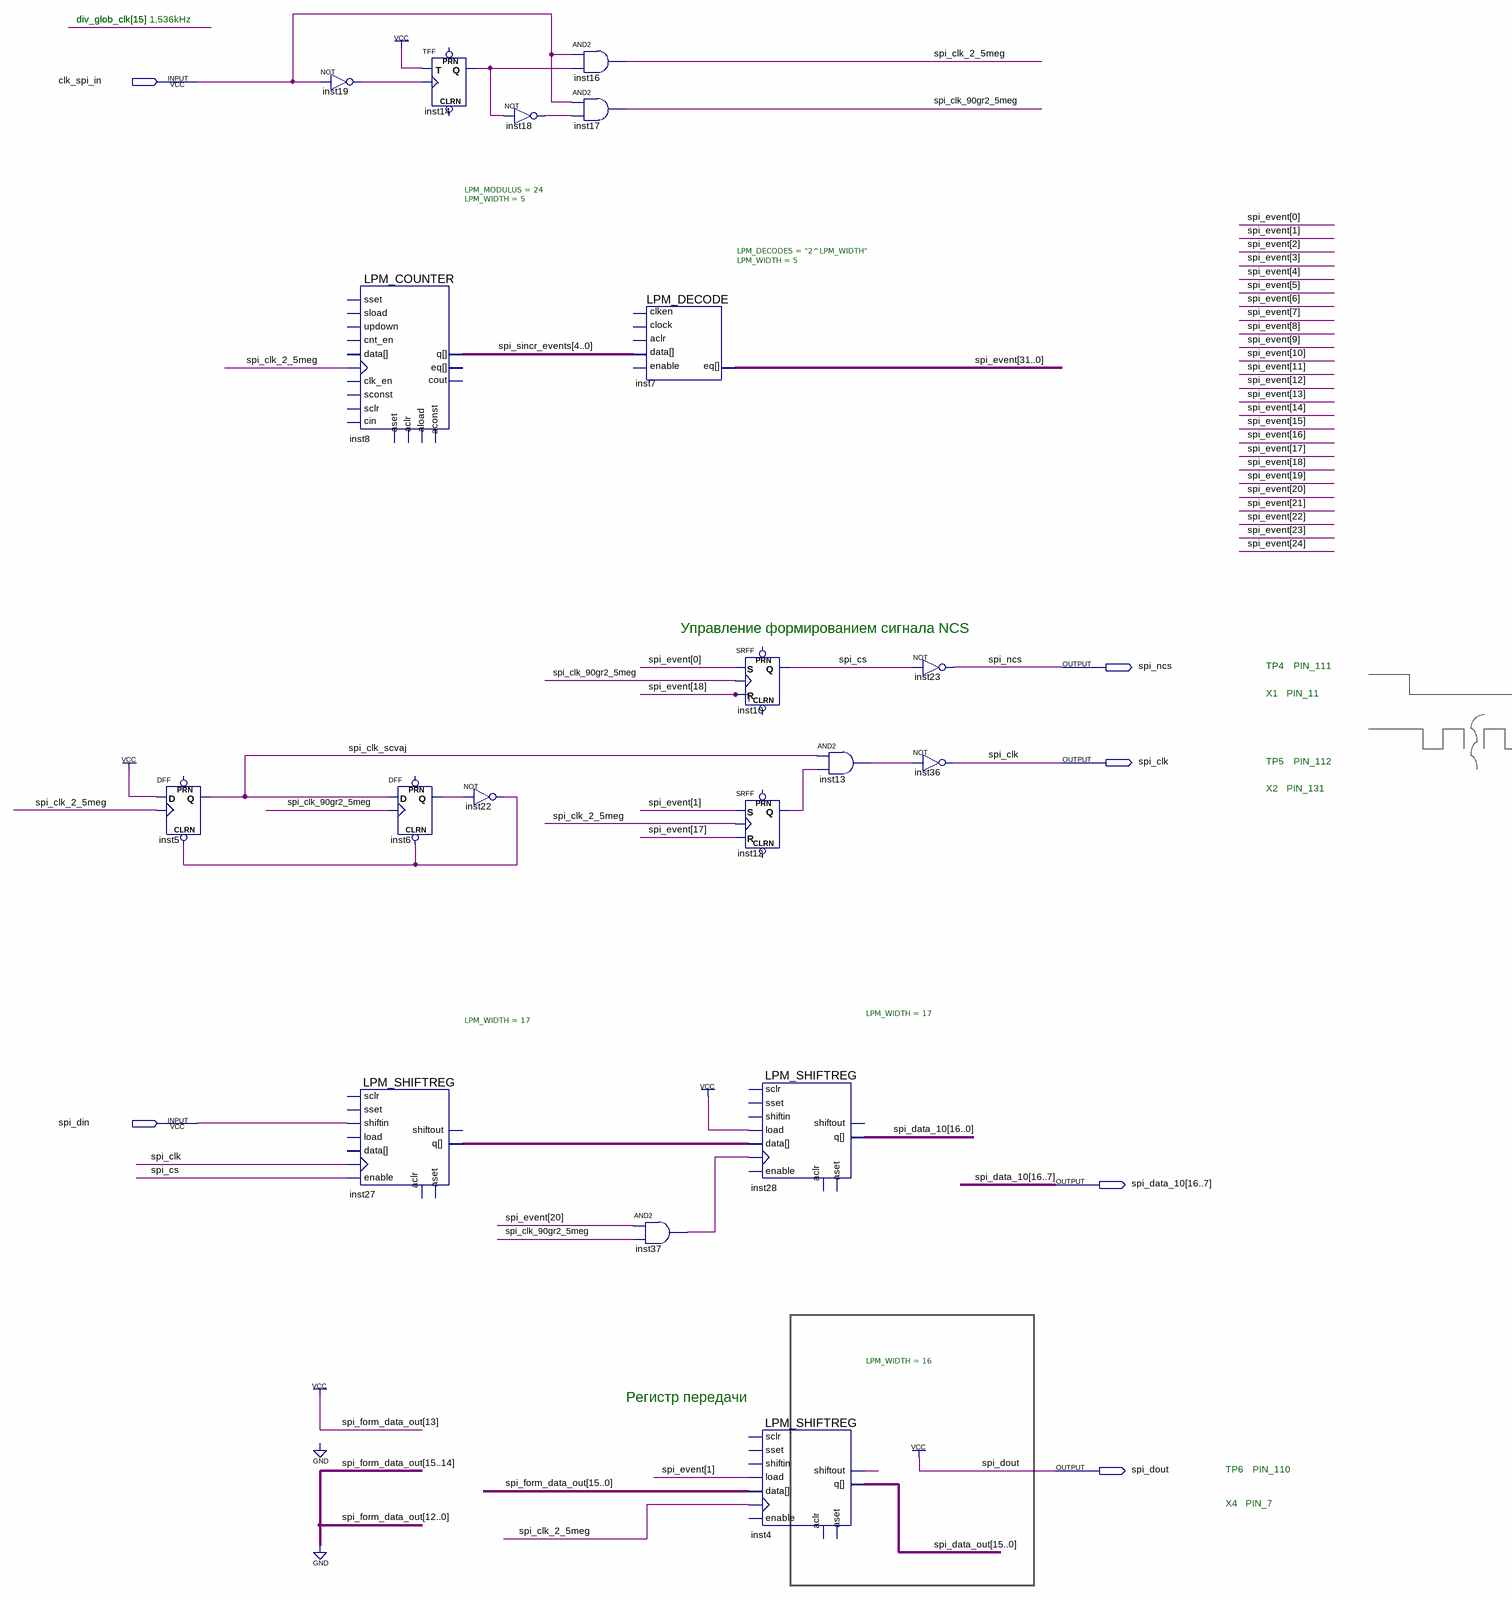
[diagram p0: schematic sheet]
// Quartus schematic sss_spi16_termo.bdf as structural Verilog: 19 symbols, 6 pins
module sss_spi16_termo (
  input  clk_spi_in,
  input  spi_din,
  output spi_ncs,
  output spi_clk,
  output [16:0] spi_data_10,
  output spi_dout
);

  wire inst4_shiftout, inst6_q, inst12_q, inst13_out, inst14_q, inst18_out, inst19_out, inst22_out,
       inst37_out, spi_clk_2_5meg, spi_clk_90gr2_5meg, spi_clk_scvaj, spi_cs;
  wire [4:0] spi_sincr_events;
  wire [15:0] spi_data_out;
  wire [16:0] inst27_q;
  wire [31:0] spi_event;

  DFF inst5 (.CLRN(inst22_out), .CLK(spi_clk_2_5meg), .D(1'b1), .Q(spi_clk_scvaj));  // open: PRN
  not inst19 (inst19_out, clk_spi_in);
  LPM_COUNTER #(.LPM_MODULUS(24), .LPM_WIDTH(5)) inst8 (
    .clock(spi_clk_2_5meg), .q(spi_sincr_events));  // open: sset, sload, updown, cnt_en, data, clk_en, sconst, sclr, aload, aclr, aset, aconst, cin, eq, cout
  LPM_SHIFTREG #(.LPM_WIDTH(17)) inst27 (
    .shiftin(spi_din), .enable(spi_cs), .clock(spi_clk), .q(inst27_q));  // open: sset, data, load, sclr, aset, aclr, shiftout
  TFF inst14 (.T(1'b1), .CLK(inst19_out), .Q(inst14_q));  // open: PRN, CLRN
  DFF inst6 (.CLRN(inst22_out), .CLK(spi_clk_90gr2_5meg), .D(spi_clk_scvaj), .Q(inst6_q));  // open: PRN
  not inst22 (inst22_out, inst6_q);
  not inst18 (inst18_out, inst14_q);
  and inst16 (spi_clk_2_5meg, clk_spi_in, inst14_q);
  and inst17 (spi_clk_90gr2_5meg, clk_spi_in, inst18_out);
  LPM_DECODE #(.LPM_DECODES("2^LPM_WIDTH"), .LPM_WIDTH(5)) inst7 (
    .data(spi_sincr_events), .eq(spi_event));  // open: enable, clken, clock, aclr
  and inst37 (inst37_out, spi_event[20], spi_clk_90gr2_5meg);
  SRFF inst10 (.S(spi_event[0]), .R(spi_event[18]), .CLK(spi_clk_90gr2_5meg), .Q(spi_cs));  // open: PRN, CLRN
  SRFF inst12 (.S(spi_event[1]), .R(spi_event[17]), .CLK(spi_clk_2_5meg), .Q(inst12_q));  // open: PRN, CLRN
  LPM_SHIFTREG #(.LPM_WIDTH(17)) inst28 (
    .clock(inst37_out), .data(inst27_q), .load(1'b1), .q(spi_data_10));  // open: shiftin, sset, enable, sclr, aset, aclr, shiftout
  LPM_SHIFTREG #(.LPM_WIDTH(16)) inst4 (
    .clock(spi_clk_2_5meg), .data(16'b0010000000000000), .load(spi_event[1]), .shiftout(inst4_shiftout),
    .q(spi_data_out));  // open: shiftin, sset, enable, sclr, aset, aclr
  and inst13 (inst13_out, spi_clk_scvaj, inst12_q);
  not inst23 (spi_ncs, spi_cs);
  not inst36 (spi_clk, inst13_out);

  assign spi_dout = 1'b1;

  // Notes on the sheet:
  //   div_glob_clk[15]
  //   1,536kHz
  //   Управление формированием сигнала NCS
  //   TP4
  //   PIN_111
  //   X1
  //   PIN_11
  //   TP5
  //   PIN_112
  //   X2
  //   PIN_131
  //   Регистр передачи
  //   TP6
  //   PIN_110
  //   X4
  //   PIN_7
endmodule
